# Altium schematic sheet schematics_2025-02-16.schdoc
size 210 x 124 mm
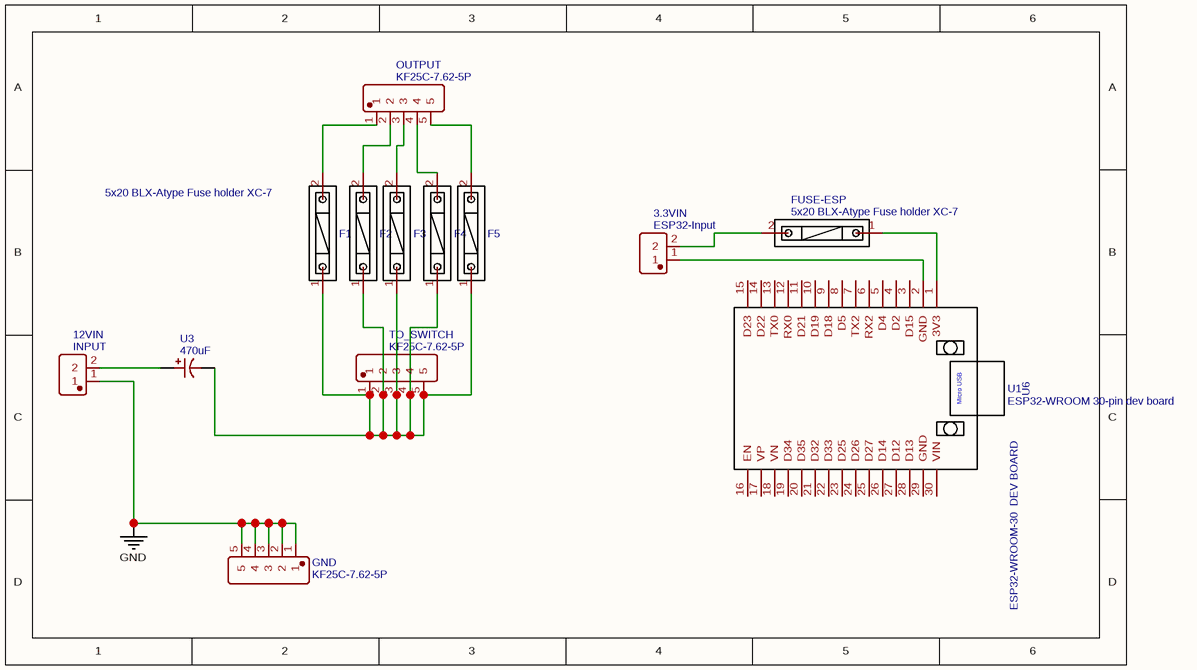
[diagram p0: schematics_2025-02-16.schdoc]

## Parts
3.3VIN  ESP32-Input  [CONN-TH_KF25H-7.62-2P]
12VIN  INPUT  [CONN-TH_KF25H-7.62-2P]
F1  5x20 BLX-Atype Fuse holder XC-7  [FUSE-TH_L22.6-W9.0]
F2  5x20 BLX-Atype Fuse holder XC-7  [FUSE-TH_L22.6-W9.0]  (value not drawn)
F3  5x20 BLX-Atype Fuse holder XC-7  [FUSE-TH_L22.6-W9.0]  (value not drawn)
F4  5x20 BLX-Atype Fuse holder XC-7  [FUSE-TH_L22.6-W9.0]  (value not drawn)
F5  5x20 BLX-Atype Fuse holder XC-7  [FUSE-TH_L22.6-W9.0]  (value not drawn)
FUSE-ESP  5x20 BLX-Atype Fuse holder XC-7  [FUSE-TH_L22.6-W9.0]
GND  KF25C-7.62-5P  [CONN-TH_KF25C-7.62-5P]
OUTPUT  KF25C-7.62-5P  [CONN-TH_KF25C-7.62-5P]
TO_SWITCH  KF25C-7.62-5P  [CONN-TH_KF25C-7.62-5P]
U1  ESP32-WROOM 30-pin dev board  [ESP32-WROOM-30-DEVBOARD]
U3  470uF  [CAP-SMD_BD8.0-L8.3-W8.3-LS8.9-FD]

## Nets
GND: 12VIN.1 GND.1 GND.2 GND.3 GND.4 GND.5
Net3.3VIN_1: 3.3VIN.1 U1.2(GND)
Net3.3VIN_2: 3.3VIN.2 FUSE-ESP.2
Net12VIN_2: 12VIN.2 U3.1
NetF1_1: F1.1 F2.1 F3.1 F4.1 F5.1 TO_SWITCH.1 TO_SWITCH.2 TO_SWITCH.3 TO_SWITCH.4 TO_SWITCH.5 U3.2
NetF1_2: F1.2 OUTPUT.1
NetF2_2: F2.2 OUTPUT.2
NetF3_2: F3.2 OUTPUT.3
NetF4_2: F4.2 OUTPUT.4
NetF5_2: F5.2 OUTPUT.5
NetFUSE-ESP_1: FUSE-ESP.1 U1.1(3V3)

Not connected (* = marked no-connect by the designer): U1 3(D15) 4(D2) 5(D4) 6(RX2) 7(TX2) 8(D5) 9(D18) 10(D19) 11(D21) 12(RX0) 13(TX0) 14(D22) 15(D23) 16(EN) 17(VP) 18(VN) 19(D34) 20(D35) 21(D32) 22(D33) 23(D25) 24(D26) 25(D27) 26(D14) 27(D12) 28(D13) 29(GND) 30(VIN)

## Notes on the sheet
- (in symbol ESP32-WROOM 30-pin dev board) U6; Micro USB; ESP32-WROOM-30  DEV BOARD

## Library data of the parts
3.3VIN = ESP32-Input: Manufacturer: KEFA(科发); Manufacturer Part: KF25H-7.62-2P; Contributor: LCSC; Supplier: LCSC; Supplier Part: C707373; JLCPCB Part Class: Extended Part; spicePre: U; spiceSymbolName: KF25H-7.62-2P
12VIN = INPUT: Manufacturer: KEFA(科发); Manufacturer Part: KF25H-7.62-2P; Contributor: LCSC; Supplier: LCSC; Supplier Part: C707373; JLCPCB Part Class: Extended Part; spicePre: U; spiceSymbolName: KF25H-7.62-2P
F1-F5 FUSE-ESP = 5x20 BLX-Atype Fuse holder XC-7: Manufacturer Part: 5x20 BLX-A型 保险丝支架 XC-7; Manufacturer: xcfuse(旭程); Supplier: LCSC; Supplier Part: C3131; JLCPCB Part Class: Extended Part; spicePre: F; spiceSymbolName: 5x20 BLX-Atype Fuse holder XC-7
GND OUTPUT TO_SWITCH = KF25C-7.62-5P: Manufacturer: KEFA(科发); Contributor: LCSC; Supplier: LCSC; Supplier Part: C707364; Manufacturer Part: KF25C-7.62-5P; JLCPCB Part Class: Extended Part; spicePre: U; spiceSymbolName: KF25C-7.62-5P
U1 = ESP32-WROOM 30-pin dev board: Contributor: viana7339; spicePre: U; spiceSymbolName: ESP32-WROOM 30-pin dev board
U3 = 470uF: Manufacturer: KNSCHA(科尼盛); Manufacturer Part: VT470UF16V167RV0135; nameAlias: Value; Contributor: lcsc; Supplier: LCSC; Supplier Part: C5246586; JLCPCB Part Class: Extended Part; spicePre: U; spiceSymbolName: VT470UF16V167RV0135